# EAGLE schematic 0243_imu (EAGLE 9.6.2)
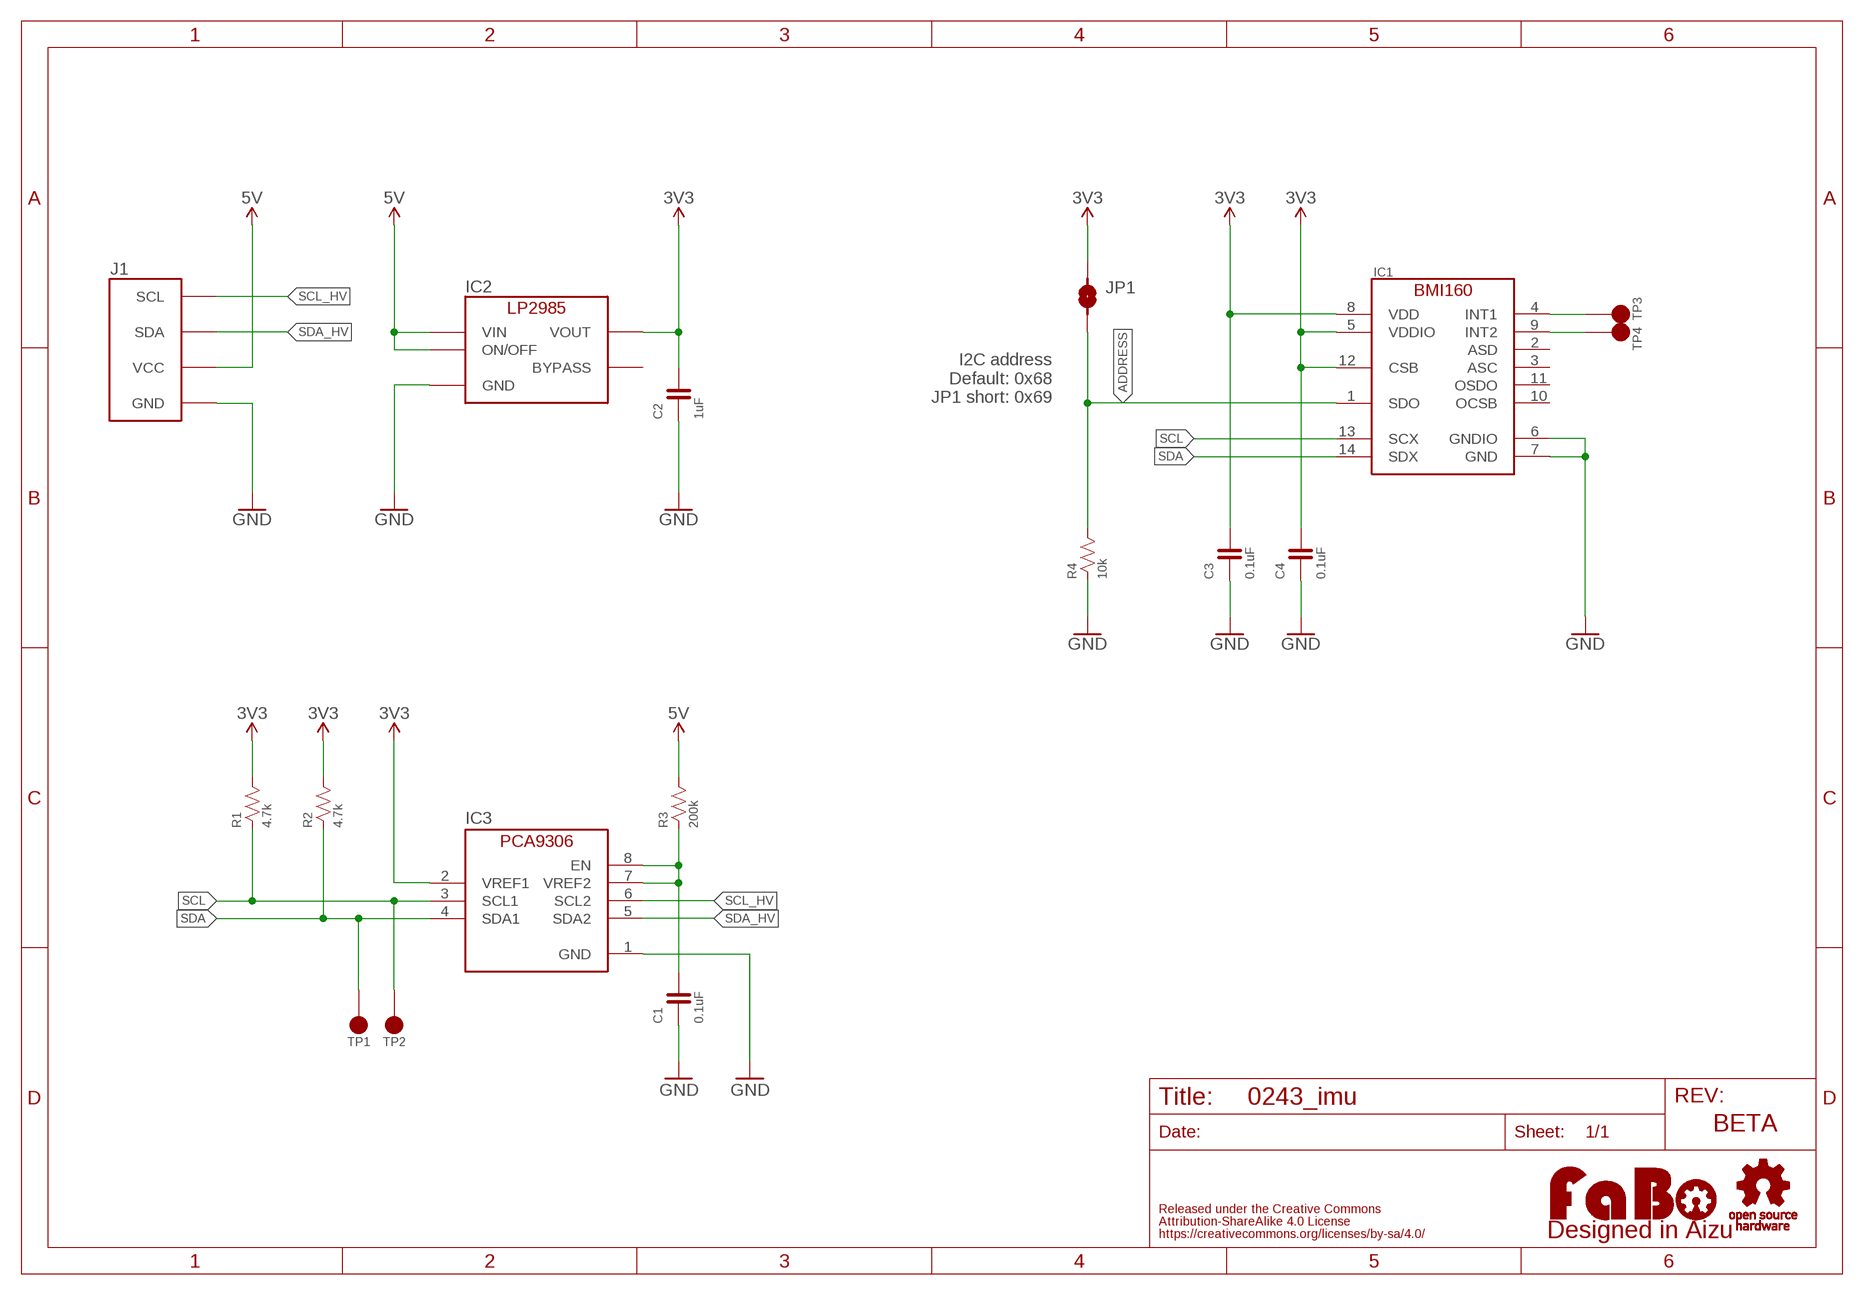
[diagram p0: schematic, sheet 1]

## Parts
C1  0.1uF  CAPACITOR-0603  [EIA0603]
C2  1uF  CAPACITOR-0603  [EIA0603]
C3  0.1uF  CAPACITOR-0603  [EIA0603]
C4  0.1uF  CAPACITOR-0603  [EIA0603]
IC1  BMI160  [BMI160]
IC2  LP2985-33DBV  [SOT-23-5]
IC3  PCA9306GM  [XQFN8]
J1  FABO_BRICK_I2C  [FABO_BRICK_I2C]
JP1  JUMPER-2_SMD  [JUMPER-SMD-2]
LOGO1  LOGO_FABO-M  [LOGO_FABO_M]
R1  4.7k  RESISTOR-0603  [EIA0603]
R2  4.7k  RESISTOR-0603  [EIA0603]
R3  200k  RESISTOR-0603  [EIA0603]
R4  10k  RESISTOR-0603  [EIA0603]
TP1  TP-15  [TP-15]
TP2  TP-15  [TP-15]
TP3  TP-15  [TP-15]
TP4  TP-15  [TP-15]
U$2  LOGO_OSHW-M_BOTTOM  [LOGO_OSHW_M_BOTTOM]

## Nets
3V3: C2.2 C3.2 C4.2 IC1.5(VDDIO) IC1.8(VDD) IC1.12(CSB) IC2.5(VOUT) IC3.2(VREF1) JP1.1 R1.2 R2.2
5V: IC2.1(VIN) IC2.3(ON/OFF) J1.VCC R3.2
ADDRESS: IC1.1(SDO) JP1.2 R4.2
GND: C1.1 C2.1 C3.1 C4.1 IC1.6(GNDIO) IC1.7(GND) IC2.2(GND) IC3.1(GND) J1.GND R4.1
INT1: IC1.4(INT1) TP3.1
INT2: IC1.9(INT2) TP4.1
PCAVREF: C1.2 IC3.7(VREF2) IC3.8(EN) R3.1
SCL: IC1.13(SCX) IC3.3(SCL1) R1.1 TP2.1
SCL_HV: IC3.6(SCL2) J1.SCL
SDA: IC1.14(SDX) IC3.4(SDA1) R2.1 TP1.1
SDA_HV: IC3.5(SDA2) J1.SDA
Unconnected: IC1.2(ASD) IC1.3(ASC) IC1.10(OCSB) IC1.11(OSDO) IC2.4(BYPASS)

## Notes on the sheet
- I2C address
  Default: 0x68
  JP1 short: 0x69
- BETA

## Library data of the parts
C1-C4 = component:CAPACITOR
IC1 = component:BMI160
IC2 = FaBo-Supply:LP2985: LP2985
IC3 = FaBo-LevelTranslator:PCA9306
J1 = FaBo-Template:FABO_BRICK_I2C: FaBo Brick I2C
JP1 = component:JUMPER-2
LOGO1 = component:LOGO_FABO
R1-R4 = component:RESISTOR
TP1-TP4 = component:TP
U$2 = FaBo-etc:LOGO_OSHW